# EAGLE design Universal-Sensor_Atmega328 (EAGLE 6.6.0)
Assembly variants: Atmega + TH, P, L, Max (RF), Atmega + TH, P, MAX (RF), Atmega + TH, L, MAX (RF), Atmega + TH, MAX (RF), Atmega + TH, P, L, (Wired)
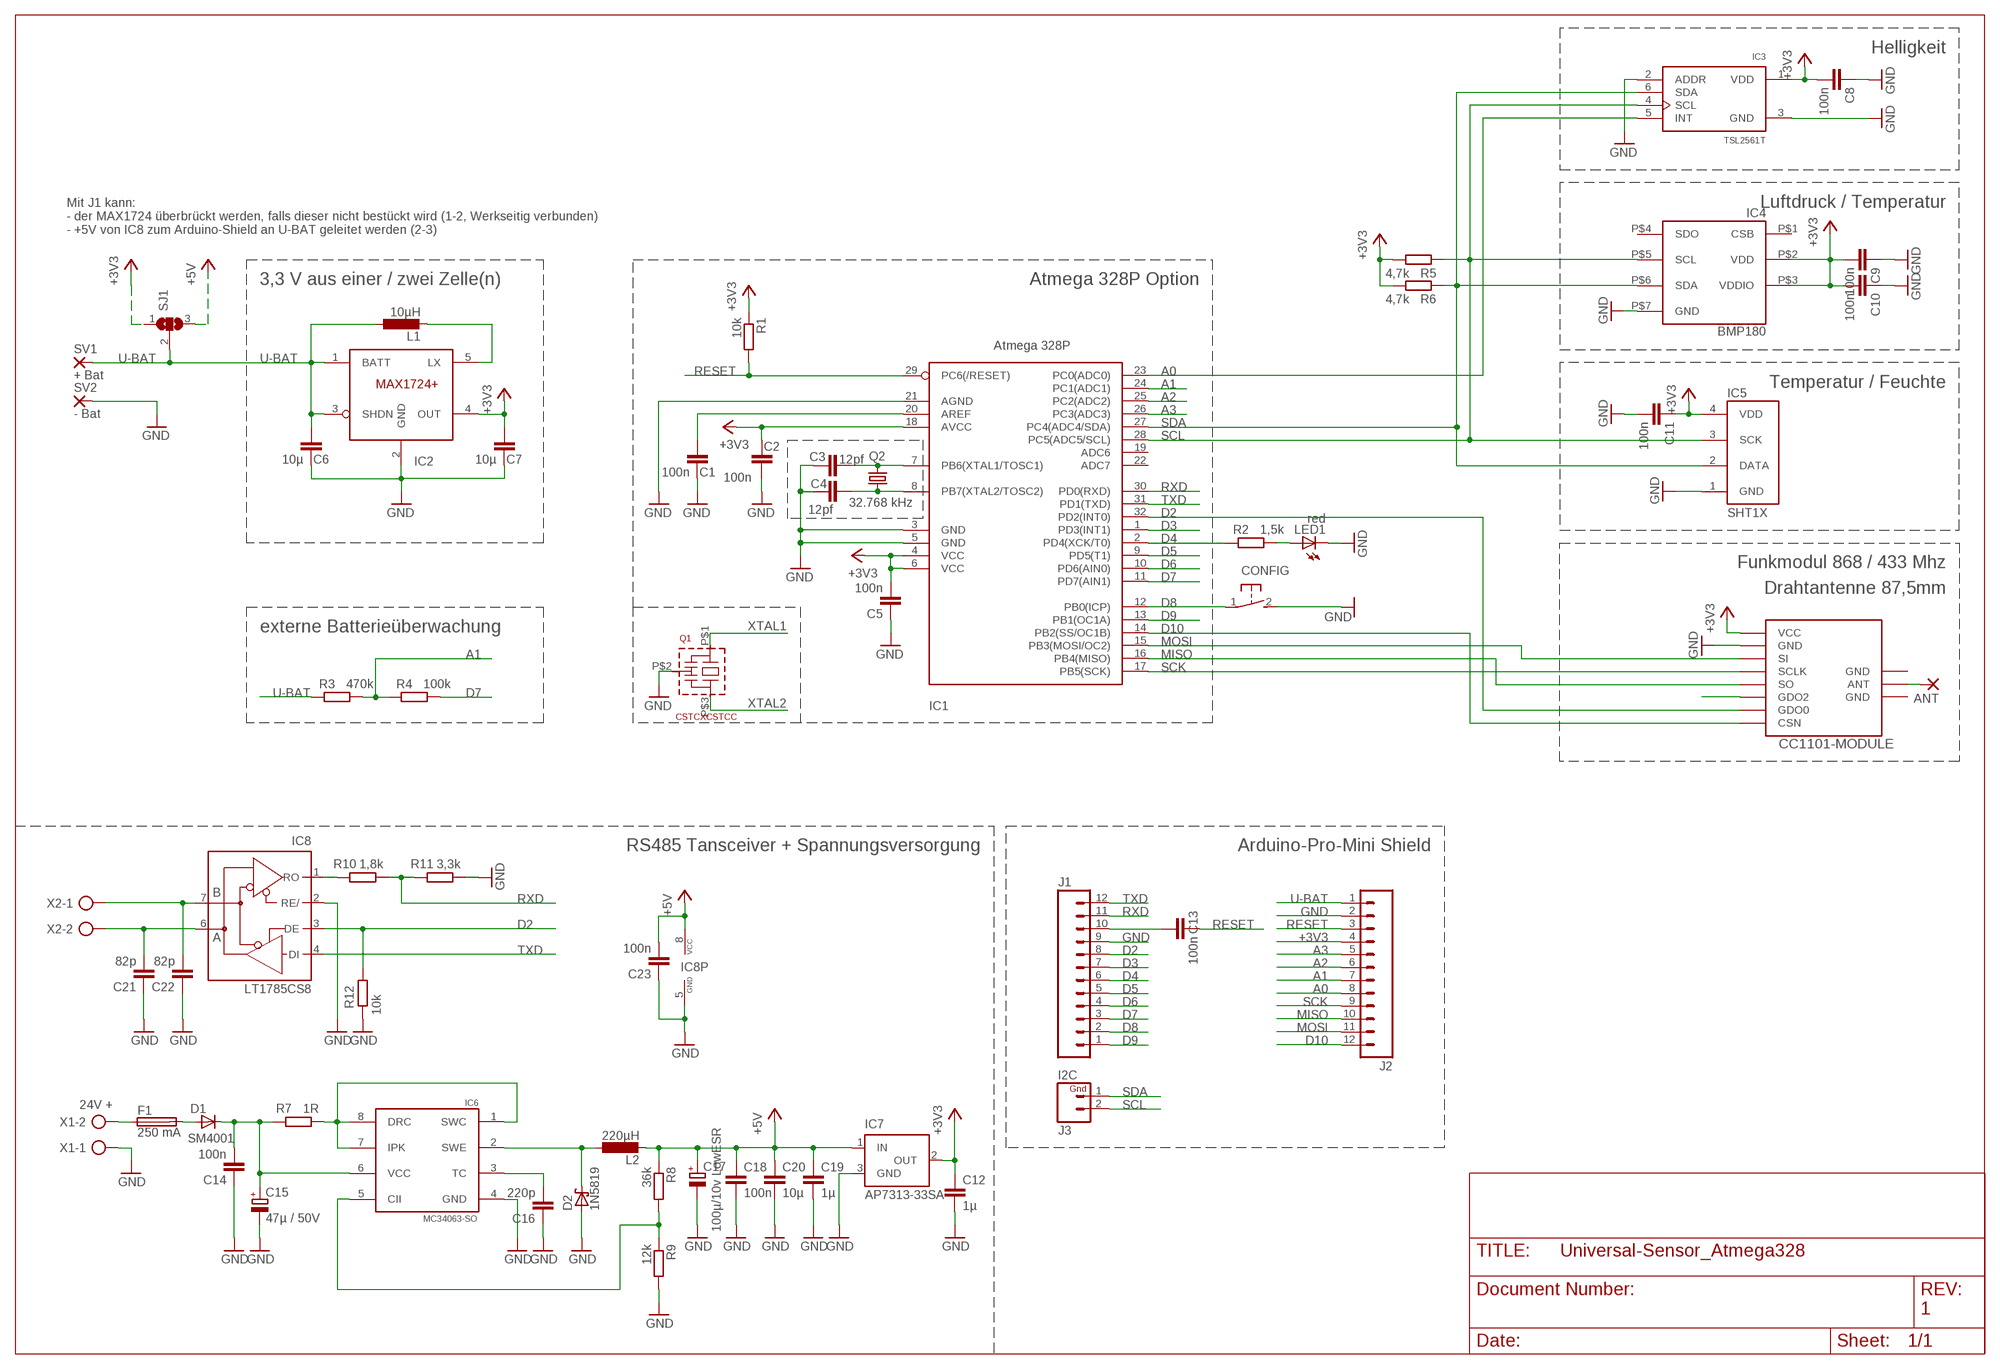
[diagram p0: schematic, sheet 1]

## Parts
ANT  1,6/0,8  [1,6/0,8]  (not fitted in variant Atmega + TH, P, L, (Wired))
C1  100n  C-EUC0805  [C0805]
C2  100n  C-EUC0805  [C0805]
C3  12pf  C-EUC0805  [C0805]  (not fitted in variant Atmega + TH, P, L, Max (RF))  (not fitted in variant Atmega + TH, P, MAX (RF))  (not fitted in variant Atmega + TH, L, MAX (RF))  (not fitted in variant Atmega + TH, MAX (RF))  (not fitted in variant Atmega + TH, P, L, (Wired))
C4  12pf  C-EUC0805  [C0805]  (not fitted in variant Atmega + TH, P, L, Max (RF))  (not fitted in variant Atmega + TH, P, MAX (RF))  (not fitted in variant Atmega + TH, L, MAX (RF))  (not fitted in variant Atmega + TH, MAX (RF))  (not fitted in variant Atmega + TH, P, L, (Wired))
C5  100n  C-EUC0805  [C0805]
C6  10µ  C-EUC1206  [C1206]  (not fitted in variant Atmega + TH, P, L, (Wired))
C7  10µ  C-EUC1206  [C1206]  (not fitted in variant Atmega + TH, P, L, (Wired))
C8  100n  C-EUC0805  [C0805]  (not fitted in variant Atmega + TH, P, MAX (RF))  (not fitted in variant Atmega + TH, MAX (RF))
C9  100n  C-EUC0805  [C0805]  (not fitted in variant Atmega + TH, L, MAX (RF))  (not fitted in variant Atmega + TH, MAX (RF))
C10  100n  C-EUC0805  [C0805]  (not fitted in variant Atmega + TH, L, MAX (RF))  (not fitted in variant Atmega + TH, MAX (RF))
C11  100n  C-EUC0805  [C0805]
C12  1µ  C-EUC0805  [C0805]  (not fitted in variant Atmega + TH, P, L, Max (RF))  (not fitted in variant Atmega + TH, P, MAX (RF))  (not fitted in variant Atmega + TH, L, MAX (RF))  (not fitted in variant Atmega + TH, MAX (RF))
C13  100n  C-EUC0805  [C0805]
C14  100n  C-EUC1206  [C1206]  (not fitted in variant Atmega + TH, P, L, Max (RF))  (not fitted in variant Atmega + TH, P, MAX (RF))  (not fitted in variant Atmega + TH, L, MAX (RF))  (not fitted in variant Atmega + TH, MAX (RF))
C15  47µ / 50V  CPOL-EUE2.5-7  [E2,5-7]  (not fitted in variant Atmega + TH, P, L, Max (RF))  (not fitted in variant Atmega + TH, P, MAX (RF))  (not fitted in variant Atmega + TH, L, MAX (RF))  (not fitted in variant Atmega + TH, MAX (RF))
C16  220p  C-EUC0805  [C0805]  (not fitted in variant Atmega + TH, P, L, Max (RF))  (not fitted in variant Atmega + TH, P, MAX (RF))  (not fitted in variant Atmega + TH, L, MAX (RF))  (not fitted in variant Atmega + TH, MAX (RF))
C17  100µ/10v LowESR  CPOL-EUSMCD  [SMC_D]  (not fitted in variant Atmega + TH, P, L, Max (RF))  (not fitted in variant Atmega + TH, P, MAX (RF))  (not fitted in variant Atmega + TH, L, MAX (RF))  (not fitted in variant Atmega + TH, MAX (RF))
C18  100n  C-EUC0805  [C0805]  (not fitted in variant Atmega + TH, P, L, Max (RF))  (not fitted in variant Atmega + TH, P, MAX (RF))  (not fitted in variant Atmega + TH, L, MAX (RF))  (not fitted in variant Atmega + TH, MAX (RF))
C19  1µ  C-EUC0805  [C0805]  (not fitted in variant Atmega + TH, P, L, Max (RF))  (not fitted in variant Atmega + TH, P, MAX (RF))  (not fitted in variant Atmega + TH, L, MAX (RF))  (not fitted in variant Atmega + TH, MAX (RF))
C20  10µ  C-EUC1206  [C1206]  (not fitted in variant Atmega + TH, P, L, Max (RF))  (not fitted in variant Atmega + TH, P, MAX (RF))  (not fitted in variant Atmega + TH, L, MAX (RF))  (not fitted in variant Atmega + TH, MAX (RF))
C21  82p  C-EUC0805  [C0805]  (not fitted in variant Atmega + TH, P, L, Max (RF))  (not fitted in variant Atmega + TH, P, MAX (RF))  (not fitted in variant Atmega + TH, L, MAX (RF))  (not fitted in variant Atmega + TH, MAX (RF))
C22  82p  C-EUC0805  [C0805]  (not fitted in variant Atmega + TH, P, L, Max (RF))  (not fitted in variant Atmega + TH, P, MAX (RF))  (not fitted in variant Atmega + TH, L, MAX (RF))  (not fitted in variant Atmega + TH, MAX (RF))
C23  100n  C-EUC0805  [C0805]  (not fitted in variant Atmega + TH, P, L, Max (RF))  (not fitted in variant Atmega + TH, P, MAX (RF))  (not fitted in variant Atmega + TH, L, MAX (RF))  (not fitted in variant Atmega + TH, MAX (RF))
CC1101-MODULE  CC1101_WIRELES_MODULE  [CC1101_WIRELES_MODULE]  (not fitted in variant Atmega + TH, P, L, (Wired))
CONFIG  DTSM-3  [DTSM-3]
D1  SM4001  DIODE-MELF-MLL41  [MELF-MLL41]  (not fitted in variant Atmega + TH, P, L, Max (RF))  (not fitted in variant Atmega + TH, P, MAX (RF))  (not fitted in variant Atmega + TH, L, MAX (RF))  (not fitted in variant Atmega + TH, MAX (RF))
D2  1N5819  SCHOTTKY-DIODESMD  [SMB]  (not fitted in variant Atmega + TH, P, L, Max (RF))  (not fitted in variant Atmega + TH, P, MAX (RF))  (not fitted in variant Atmega + TH, L, MAX (RF))  (not fitted in variant Atmega + TH, MAX (RF))
F1  250 mA  SMD-MICRO-FUSE  [SMD-6,1X2,6]  (not fitted in variant Atmega + TH, P, L, Max (RF))  (not fitted in variant Atmega + TH, P, MAX (RF))  (not fitted in variant Atmega + TH, L, MAX (RF))  (not fitted in variant Atmega + TH, MAX (RF))
IC1  Atmega 328P  MEGA8-AI  [TQFP32-08]
IC2  MAX1724  [SOT23-5L]  (not fitted in variant Atmega + TH, P, L, (Wired))
IC3  TSL2561T  TSL2560  [TMB-6]  (not fitted in variant Atmega + TH, MAX (RF))  (not fitted in variant Atmega + TH, P, MAX (RF))
IC4  BMP180  [LGA-7]  (not fitted in variant Atmega + TH, L, MAX (RF))  (not fitted in variant Atmega + TH, MAX (RF))
IC5  SHT1X  [SHT1X]
IC6  MC34063-SO  [SO8]  (not fitted in variant Atmega + TH, P, L, Max (RF))  (not fitted in variant Atmega + TH, P, MAX (RF))  (not fitted in variant Atmega + TH, L, MAX (RF))  (not fitted in variant Atmega + TH, MAX (RF))
IC7  AP7313-33SA  MAX6520  [SOT23]  (not fitted in variant Atmega + TH, P, L, Max (RF))  (not fitted in variant Atmega + TH, P, MAX (RF))  (not fitted in variant Atmega + TH, L, MAX (RF))  (not fitted in variant Atmega + TH, MAX (RF))  (not fitted in variant Atmega + TH, P, L, (Wired))
IC8  LT1785CS8  MAX481CSA  [SO08]  (not fitted in variant Atmega + TH, P, L, Max (RF))  (not fitted in variant Atmega + TH, P, MAX (RF))  (not fitted in variant Atmega + TH, L, MAX (RF))  (not fitted in variant Atmega + TH, MAX (RF))
J1  M12PTH  [1X12]  (not fitted in variant Atmega + TH, P, L, Max (RF))  (not fitted in variant Atmega + TH, P, MAX (RF))  (not fitted in variant Atmega + TH, L, MAX (RF))  (not fitted in variant Atmega + TH, MAX (RF))  (not fitted in variant Atmega + TH, P, L, (Wired))
J2  M12PTH  [1X12]  (not fitted in variant Atmega + TH, P, L, Max (RF))  (not fitted in variant Atmega + TH, P, MAX (RF))  (not fitted in variant Atmega + TH, L, MAX (RF))  (not fitted in variant Atmega + TH, MAX (RF))  (not fitted in variant Atmega + TH, P, L, (Wired))
J3  I2C  M02PTH  [1X02]  (not fitted in variant Atmega + TH, P, L, Max (RF))  (not fitted in variant Atmega + TH, P, MAX (RF))  (not fitted in variant Atmega + TH, L, MAX (RF))  (not fitted in variant Atmega + TH, MAX (RF))  (not fitted in variant Atmega + TH, P, L, (Wired))
L1  10µH  L-EUL4532P  [L4532P]  (not fitted in variant Atmega + TH, P, L, (Wired))
L2  220µH  L-EUL5650M  [L5650M]  (not fitted in variant Atmega + TH, P, L, Max (RF))  (not fitted in variant Atmega + TH, P, MAX (RF))  (not fitted in variant Atmega + TH, L, MAX (RF))  (not fitted in variant Atmega + TH, MAX (RF))
LED1  red  LEDCHIP-LED0805  [CHIP-LED0805]
Q1  CSTCXCSTCC  [CSTCC]  (not fitted in variant Atmega + TH, P, L, Max (RF))  (not fitted in variant Atmega + TH, L, MAX (RF))  (not fitted in variant Atmega + TH, MAX (RF))  (not fitted in variant Atmega + TH, P, MAX (RF))
Q2  32.768 kHz  CRYSTALTC38H  [TC38H]  (not fitted in variant Atmega + TH, P, L, Max (RF))  (not fitted in variant Atmega + TH, P, MAX (RF))  (not fitted in variant Atmega + TH, L, MAX (RF))  (not fitted in variant Atmega + TH, MAX (RF))  (not fitted in variant Atmega + TH, P, L, (Wired))
R1  10k  R-EU_M0805  [M0805]
R2  1,5k  R-EU_M0805  [M0805]
R3  470k  R-EU_M0805  [M0805]  (not fitted in variant Atmega + TH, P, L, (Wired))
R4  100k  R-EU_M0805  [M0805]  (not fitted in variant Atmega + TH, P, L, (Wired))
R5  4,7k  R-EU_M0805  [M0805]
R6  4,7k  R-EU_M0805  [M0805]
R7  1R  R-EU_R0805  [R0805]  (not fitted in variant Atmega + TH, P, L, Max (RF))  (not fitted in variant Atmega + TH, P, MAX (RF))  (not fitted in variant Atmega + TH, L, MAX (RF))  (not fitted in variant Atmega + TH, MAX (RF))
R8  36k  R-EU_R0805  [R0805]  (not fitted in variant Atmega + TH, P, L, Max (RF))  (not fitted in variant Atmega + TH, P, MAX (RF))  (not fitted in variant Atmega + TH, L, MAX (RF))  (not fitted in variant Atmega + TH, MAX (RF))
R9  12k  R-EU_R0805  [R0805]  (not fitted in variant Atmega + TH, P, L, Max (RF))  (not fitted in variant Atmega + TH, P, MAX (RF))  (not fitted in variant Atmega + TH, L, MAX (RF))  (not fitted in variant Atmega + TH, MAX (RF))
R10  1,8k  R-EU_R0805  [R0805]  (not fitted in variant Atmega + TH, P, L, Max (RF))  (not fitted in variant Atmega + TH, P, MAX (RF))  (not fitted in variant Atmega + TH, L, MAX (RF))  (not fitted in variant Atmega + TH, MAX (RF))
R11  3,3k  R-EU_R0805  [R0805]  (not fitted in variant Atmega + TH, P, L, Max (RF))  (not fitted in variant Atmega + TH, P, MAX (RF))  (not fitted in variant Atmega + TH, L, MAX (RF))  (not fitted in variant Atmega + TH, MAX (RF))
R12  10k  R-EU_M0805  [M0805]  (not fitted in variant Atmega + TH, P, L, Max (RF))  (not fitted in variant Atmega + TH, P, MAX (RF))  (not fitted in variant Atmega + TH, L, MAX (RF))  (not fitted in variant Atmega + TH, MAX (RF))
SJ1  SJ2W  [SJ_2]  (not fitted in variant Atmega + TH, P, L, Max (RF))  (not fitted in variant Atmega + TH, L, MAX (RF))  (not fitted in variant Atmega + TH, MAX (RF))  (not fitted in variant Atmega + TH, P, MAX (RF))
SV1  + Bat  1,6/0,9  [1,6/0,9]  (not fitted in variant Atmega + TH, P, L, (Wired))
SV2  - Bat  1,6/0,9  [1,6/0,9]  (not fitted in variant Atmega + TH, P, L, (Wired))
X1  AK550/2  [AK550/2]  (not fitted in variant Atmega + TH, P, L, Max (RF))  (not fitted in variant Atmega + TH, P, MAX (RF))  (not fitted in variant Atmega + TH, L, MAX (RF))  (not fitted in variant Atmega + TH, MAX (RF))
X2  AK550/2  [AK550/2]  (not fitted in variant Atmega + TH, P, L, Max (RF))  (not fitted in variant Atmega + TH, P, MAX (RF))  (not fitted in variant Atmega + TH, L, MAX (RF))  (not fitted in variant Atmega + TH, MAX (RF))

## Nets
+3V3: C2.2 C5.2 C7.2 C8.2 C9.2 C10.2 C11.1 C12.1 CC1101-MODULE.VCC IC1.4(VCC) IC1.6(VCC) IC1.18(AVCC) IC2.4(OUT) IC3.1(VDD) IC4.P$2(VDD) IC4.P$3(VDDIO) IC5.4(VDD) IC7.2(OUT) J2.4 R1.1 R5.2 R6.2 SJ1.1
+5V: C17.+ C18.1 C19.1 C20.1 C23.2 IC7.1(IN) IC8.8(VCC) L2.2 R8.1 SJ1.3
A: C21.2 IC8.6(A) X2.2
A0: IC1.23(PC0(ADC0)) IC3.5(INT) J2.8
A1: IC1.24(PC1(ADC1)) J2.7 R3.2 R4.1
A2: IC1.25(PC2(ADC2)) J2.6
A3: IC1.26(PC3(ADC3)) J2.5
B: C22.2 IC8.7(B) X2.1
D2: CC1101-MODULE.GDO0 IC1.32(PD2(INT0)) IC8.3(DE) J1.8 R12.2
D3: IC1.1(PD3(INT1)) J1.7
D4: IC1.2(PD4(XCK/T0)) J1.6 R2.1
D5: IC1.9(PD5(T1)) J1.5
D6: IC1.10(PD6(AIN0)) J1.4
D7: IC1.11(PD7(AIN1)) J1.3 R4.2
D8: CONFIG.1 IC1.12(PB0(ICP)) J1.2
D9: IC1.13(PB1(OC1A)) J1.1
D10: CC1101-MODULE.CSN IC1.14(PB2(SS/OC1B)) J2.12
GND: C1.1 C2.1 C3.2 C4.2 C5.1 C6.1 C7.1 C8.1 C9.1 C10.1 C11.2 C12.2 C14.1 C15.- C16.1 C17.- C18.2 C19.2 C20.2 C21.1 C22.1 C23.1 CC1101-MODULE.GND@1(GND) CONFIG.2 D2.A IC1.3(GND) IC1.5(GND) IC1.21(AGND) IC2.2(GND) IC3.2(ADDR) IC3.3(GND) IC4.P$7(GND) IC5.1(GND) IC6.4(GND) IC7.3(GND) IC8.2(RE/) IC8.5(GND) J1.9 J2.2 LED1.C Q1.P$2(GND) R9.2 R11.1 R12.1 SV2.1(P) X1.1
MISO: CC1101-MODULE.SO IC1.16(PB4(MISO)) J2.10
MOSI: CC1101-MODULE.SI IC1.15(PB3(MOSI/OC2)) J2.11
N$1: C13.2 J1.10
N$2: IC2.5(LX) L1.2
N$3: CC1101-MODULE.GDO2
N$4: LED1.A R2.2
N$5: ANT.1(P) CC1101-MODULE.ANT
N$9: F1.1 X1.2
N$10: IC8.1(RO) R10.2
N$14: C1.2 IC1.20(AREF)
N$16: D1.A F1.2
N$17: IC6.1(SWC) IC6.7(IPK) IC6.8(DRC) R7.1
N$19: C14.2 C15.+ D1.C IC6.6(VCC) R7.2
N$20: IC6.5(CII) R8.2 R9.1
N$21: C16.2 IC6.3(TC)
N$22: D2.C IC6.2(SWE) L2.1
RESET: C13.1 IC1.29(PC6(/RESET)) J2.3 R1.2
RXD: IC1.30(PD0(RXD)) J1.11 R10.1 R11.2
SCK: CC1101-MODULE.SCLK IC1.17(PB5(SCK)) J2.9
SCL: IC1.28(PC5(ADC5/SCL)) IC3.4(SCL) IC4.P$5(SCL) IC5.3(SCK) J3.2 R5.1
SDA: IC1.27(PC4(ADC4/SDA)) IC3.6(SDA) IC4.P$6(SDA) IC5.2(DATA) J3.1 R6.1
TXD: IC1.31(PD1(TXD)) IC8.4(DI) J1.12
U-BAT: C6.2 IC2.1(BATT) IC2.3(SHDN) J2.1 L1.1 R3.1 SJ1.2 SV1.1(P)
XTAL1: C3.1 IC1.7(PB6(XTAL1/TOSC1)) Q1.P$1 Q2.2
XTAL2: C4.1 IC1.8(PB7(XTAL2/TOSC2)) Q1.P$3 Q2.1
Unconnected: IC1.19(ADC6) IC1.22(ADC7) IC4.P$1(CSB) IC4.P$4(SDO)

## Notes on the sheet
- Helligkeit
- Luftdruck / Temperatur
- Mit J1 kann:
  - der MAX1724 überbrückt werden, falls dieser nicht bestückt wird (1-2, Werkseitig verbunden)
  - +5V von IC8 zum Arduino-Shield an U-BAT geleitet werden (2-3)
- 3,3 V aus einer / zwei Zelle(n) | Atmega 328P Option
- Temperatur / Feuchte
- IC2
- Funkmodul 868 / 433 Mhz
- Drahtantenne 87,5mm
- externe Batterieüberwachung
- RS485 Tansceiver + Spannungsversorgung | Arduino-Pro-Mini Shield
- 24V +
- 1

## Power pins joined to a net without a drawn wire
GND: CC1101-MODULE.GND@2(GND) CC1101-MODULE.GND@3(GND)

## Library data of the parts
ANT = wirepad:1,6/0,8: THROUGH-HOLE PAD
C1-C14 C16 C18-C23 = rcl:C-EU: CAPACITOR, European symbol
C15 C17 = rcl:CPOL-EU: POLARIZED CAPACITOR, European symbol
CC1101-MODULE = untitled:CC1101_WIRELES_MODULE
CONFIG = switch-tact:DTSM-3
D1 = diode:DIODE-: DIODE
D2 = diode:SCHOTTKY-DIODE: Schottky Diode
F1 = f-lf-omniblok-s:SMD-MICRO-FUSE
IC1 = atmel:MEGA8: MICROCONTROLLER 8 Kbytes FLASH 1 kbytes SRAM 512 bytes EEPROM USART 6-channel 10 bit ADC 2-channel 8 bit ADC
IC2 = MAX1724:MAX1724
IC3 = eagle-library-edeca.net-v5:TSL256*: Texas Instruments TSL2560 (SMBus), TSL2561 (I2C) Light-to-digital converter; INTERFACE: SMBus
IC4 = projecttree:BMP180
IC5 = sht10_11_15:SHT1X
IC6 = mc34063:MC34063-SO: DC/DC converter MC34063 in SO08.
IC7 = maxim:MAX6520: 1.2V Voltage Reference 50ppm/°C, SOT23, 3-Terminal Source: Data sheet <http://datasheets.maxim-ic.com/en/ds/MAX6520.pdf>; MF: MAXIM; MPN: MAX6520EUR-T; OC_FARNELL: unknown; OC_NEWARK: 02J4586
IC8 = maxim:MAX481CSA: RS485 TRANSEIVER; MF: MAXIM; MPN: MAX481CSA; OC_FARNELL: unknown; OC_NEWARK: 90C3817
J1 J2 = SparkFun:M12: Header 12 Standard 12-pin 0.1" header. Use with straight break away headers (SKU : PRT-00116), right angle break away headers (PRT-00553), swiss pins (PRT-00743), machine pins (PRT-00117), and female headers (PRT-00115).
J3 = SparkFun:M02: Header 2 Standard 2-pin 0.1" header. Use with straight break away headers (SKU : PRT-00116), right angle break away headers (PRT-00553), swiss pins (PRT-00743), machine pins (PRT-00117), and female headers (PRT-00115). Molex polarized connector foot print use with SKU : PRT-08233 with associated crimp pins and housings.
L1 L2 = rcl:L-EU: INDUCTOR, European symbol
LED1 = led:LED: LED OSRAM: - CHIPLED LG R971, LG N971, LY N971, LG Q971, LY Q971, LO R971, LY R971 LH N974, LH R974 LS Q976, LO Q976, LY Q976 LO Q996 - Hyper CHIPLED LW Q18S LB Q993, LB Q99A, LB R99A - SideLED LS A670, LO A670, LY A670, LG A670, LP A670 LB A673, LV A673, LT A673, LW A673 LH A674 LY A675 LS A676, LA A676, LO A676, LY A676, LW A676 LS A679, LY A679, LG A679 - Hyper Micro SIDELED® LS Y876, LA Y876, LO Y876, LY Y876 LT Y87S - SmartLED LW L88C, LW L88S LB L89C, LB L89S, LG L890 LS L89K, LO L89K, LY L89K LS L896, LA L896, LO L896, LY L896 - TOPLED LS T670, LO T670, LY T670, LG T670, LP T670 LSG T670, LSP T670, LSY T670, LOP T670, LYG T670 LG T671, LOG T671, LSG T671 LB T673, LV T673, LT T673, LW T673 LH T674 LS T676, LA T676, LO T676, LY T676, LB T676, LH T676, LSB T676, LW T676 LB T67C, LV T67C, LT T67C, LS T67K, LO T67K, LY T67K, LW E67C LS E67B, LA E67B, LO E67B, LY E67B, LB E67C, LV E67C, LT E67C LW T67C LS T679, LY T679, LG T679 LS T770, LO T770, LY T770, LG T770, LP T770 LB T773, LV T773, LT T773, LW T773 LH T774 LS E675, LA E675, LY E675, LS T675 LS T776, LA T776, LO T776, LY T776, LB T776 LHGB T686 LT T68C, LB T68C - Hyper Mini TOPLED® LB M676 - Mini TOPLED Santana® LG M470 LS M47K, LO M47K, LY M47K Source: http://www.osram.convergy.de LUXEON: - LUMILED® LXK2-PW12-R00, LXK2-PW12-S00, LXK2-PW14-U00, LXK2-PW14-V00 LXK2-PM12-R00, LXK2-PM12-S00, LXK2-PM14-U00 LXK2-PE12-Q00, LXK2-PE12-R00, LXK2-PE12-S00, LXK2-PE14-T00, LXK2-PE14-U00 LXK2-PB12-K00, LXK2-PB12-L00, LXK2-PB12-M00, LXK2-PB14-N00, LXK2-PB14-P00, LXK2-PB14-Q00 LXK2-PR12-L00, LXK2-PR12-M00, LXK2-PR14-Q00, LXK2-PR14-R00 LXK2-PD12-Q00, LXK2-PD12-R00, LXK2-PD12-S00 LXK2-PH12-R00, LXK2-PH12-S00 LXK2-PL12-P00, LXK2-PL12-Q00, LXK2-PL12-R00 Source: www.luxeon.com KINGBRIGHT: KA-3528ASYC Source: www.kingbright.com
Q1 = murata-cstcc-cstcv-resonators:CSTCX
Q2 = crystal:CRYSTAL: CRYSTAL; OC_FARNELL: unknown; OC_NEWARK: unknown
R1-R12 = rcl:R-EU_: RESISTOR, European symbol
SJ1 = jumper:SJ2W: SMD solder JUMPER
SV1 SV2 = wirepad:1,6/0,9: THROUGH-HOLE PAD
X1 X2 = con-ptr500:AK550/2: CONNECTOR; OC_FARNELL: unknown; OC_NEWARK: unknown

## Net classes
0 default: width 0.203 mm
1 vcc: width 0.254 mm

## Board
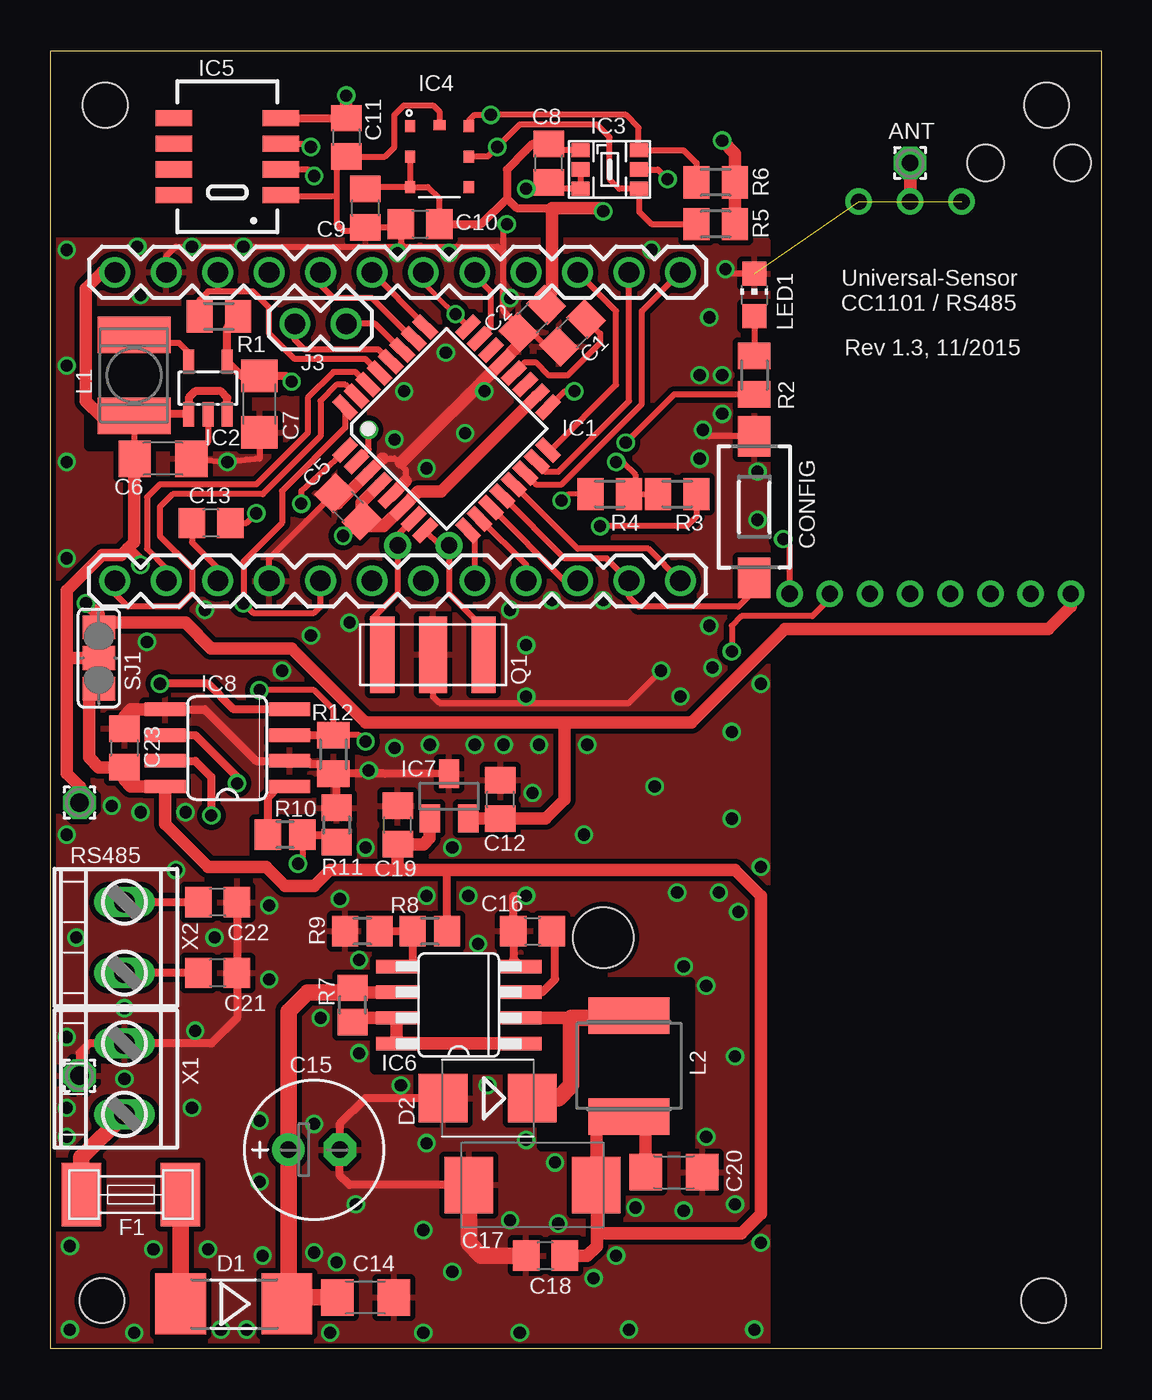
[diagram p1: board, top side]
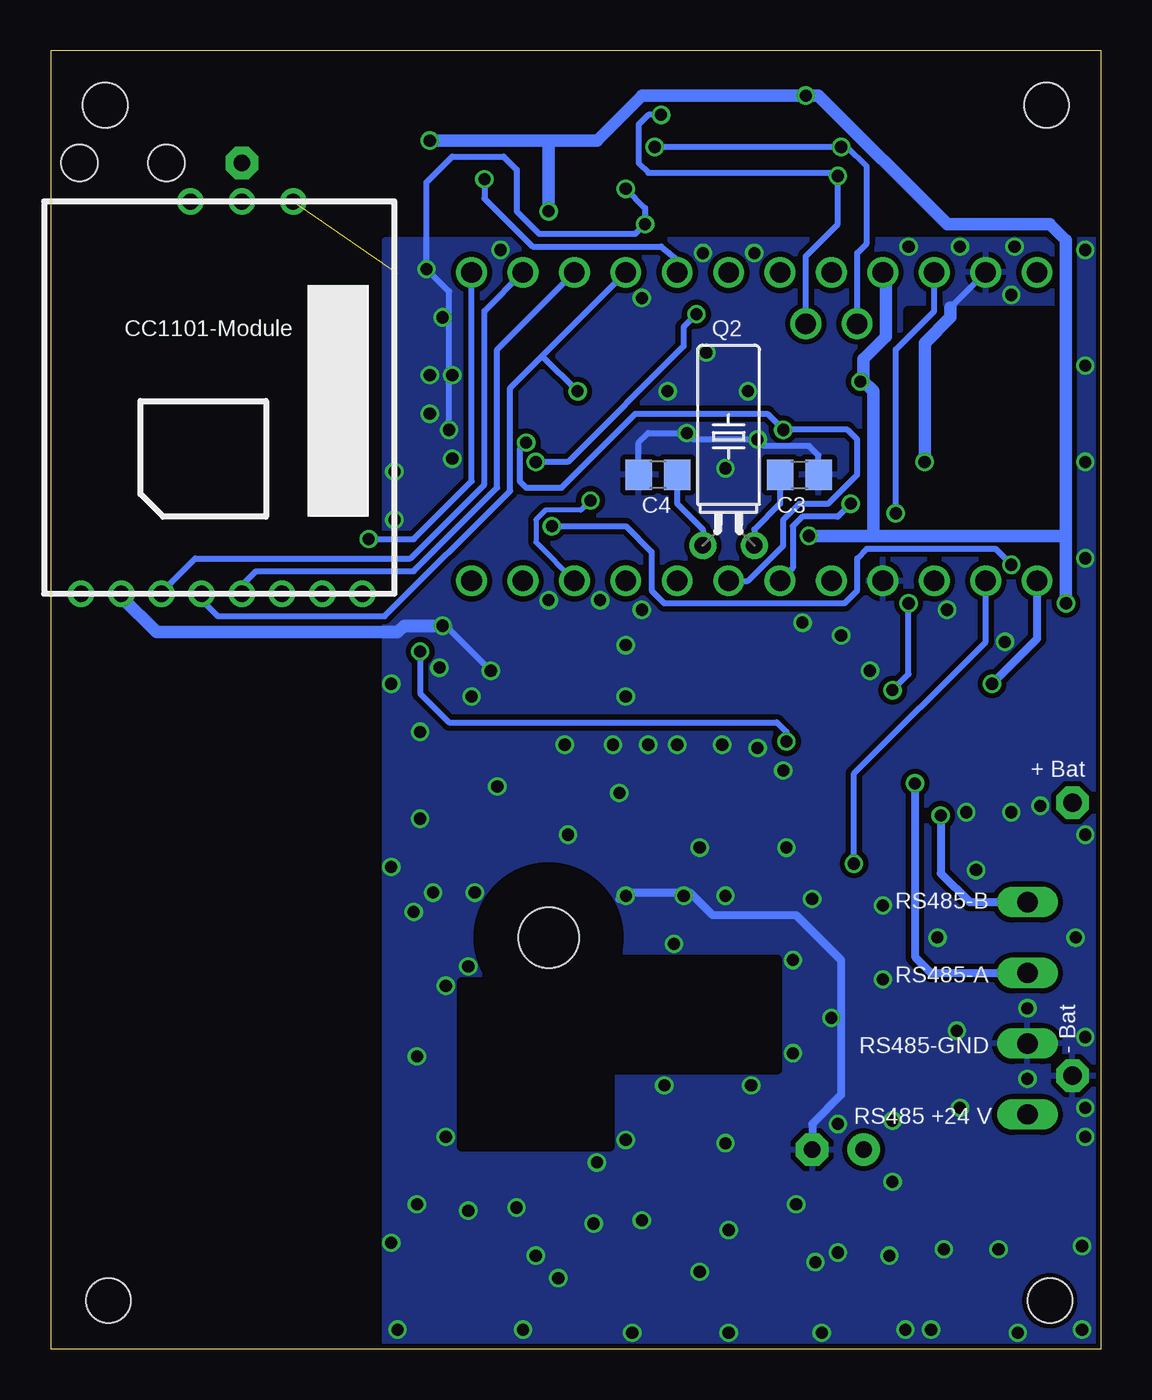
[diagram p2: board, bottom side, seen from below]

Size 51.91 x 64.14 mm. Coordinates in mm from the lower left corner, seen from the top.
Outline: 0,0 0,64.14 51.91,64.14 51.91,0 0,0
Copper layers (1*16): Top 0.035mm / dielectric 1.5mm / Bottom 0.035mm
Design rules "ITEADstudio_DRC": minimum track width 6mil, minimum drill 12mil, track to track 6mil, track to pad 6mil, pad to pad 6mil, via to via 6mil, smd to smd 0mil, copper to edge 10mil, drill to drill 10mil, minimum pad ring 10mil, minimum via ring 6mil, stop-mask expansion 2mil, vias tented up to drill 100mil, thermal gap 10mil
Holes 2.2 mm at 2.54,2.38 49.05,2.38 2.7,61.44 49.21,61.44
Holes 1.8 mm at 46.2,58.58 50.48,58.58
Holes 3 mm at 27.3,20.32
tRestrict: area 1.9,44.6 to 9.7,51.3; area 16,13.8 to 24.1,19.2; area 37,11.1 to 46.7,17.9; area 24.3,10 to 31.6,18.1
bRestrict: area 1.9,43.3 to 9.5,51.3; area 16,13.8 to 24.1,19.2; area 36.8,11.1 to 46.7,17.9; area 24.3,10 to 31.6,18.1; area 24.1,17.1 to 30.6,23.6

### Footprints (pad centres in the part's own frame; a part is rotated, then mirrored left to right if it is on the bottom)
1,6/0,8 = drill 0.813 pad 1.6 octagon: 1 0,0
C0805 = smd 1.3 x 1.5: 1 -0.95,0; 2 0.95,0
C1206 = smd 1.6 x 1.8: 1 -1.4,0; 2 1.4,0
E2,5-7 = drill 0.813 pad 1.6: + -1.27,0 | drill 0.813 pad 1.6 octagon: - 1.27,0
SMC_D = smd 2.4 x 2.8: + -3.15,0; - 3.15,0
CC1101_WIRELES_MODULE = drill 0.8: ANT 19.367,7.541; CSN 0,1.587; GDO0 0,3.572; GDO2 0,5.556; GND@1 0,13.494; GND@2 19.367,10.081; GND@3 19.367,5.001; SCLK 0,9.525; SI 0,11.509; SO 0,7.541; VCC 0,15.478
DTSM-3 = smd 2 x 1.6: 1 -3.494,0; 2 3.494,0
MELF-MLL41 = smd 2.5 x 3: A 2.625,0; C -2.625,0
SMB = smd 2.4 x 2.4: A 2.2,0; C -2.2,0
SMD-6,1X2,6 = smd 1.96 x 3.15: 1 -2.45,0; 2 2.45,0
TQFP32-08 = smd 1.27 x 0.559: 1 -4.293,2.8; 2 -4.293,2; 3 -4.293,1.2; 4 -4.293,0.4; 5 -4.293,-0.4; 6 -4.293,-1.2; 7 -4.293,-2; 8 -4.293,-2.8; 17 4.293,-2.8; 18 4.293,-2; 19 4.293,-1.2; 20 4.293,-0.4; 21 4.293,0.4; 22 4.293,1.2; 23 4.293,2; 24 4.293,2.8 | smd 0.559 x 1.27: 9 -2.8,-4.293; 10 -2,-4.293; 11 -1.2,-4.293; 12 -0.4,-4.293; 13 0.4,-4.293; 14 1.2,-4.293; 15 2,-4.293; 16 2.8,-4.293; 25 2.8,4.293; 26 2,4.293; 27 1.2,4.293; 28 0.4,4.293; 29 -0.4,4.293; 30 -1.2,4.293; 31 -2,4.293; 32 -2.8,4.293
SOT23-5L = smd 0.55 x 1.2: 1 -0.95,-1.3; 2 0,-1.3; 3 0.95,-1.3; 4 0.95,1.3; 5 -0.95,1.3
TMB-6 = smd 0.9 x 0.7: 1 -1.45,0.95; 2 -1.45,0; 3 -1.45,-0.95; 4 1.45,-0.95; 5 1.45,0; 6 1.45,0.95
LGA-7 = smd 0.6 x 0.5: P$1 1.5,1.45; P$2 0,1.45; P$3 -1.5,1.45; P$4 -1.5,-1.45; P$5 0,-1.45; P$6 1.5,-1.45 | smd 0.5 x 0.6: P$7 1.55,0
SHT1X = smd 1.803 x 0.8: 1 -2.642,1.905; 2 -2.642,0.635; 3 -2.642,-0.635; 4 -2.642,-1.905; 5 2.642,-1.905; 6 2.642,-0.635; 7 2.642,0.635; 8 2.642,1.905
SO8 = smd 0.66 x 2.032: 1 -1.905,-3.073; 2 -0.635,-3.073; 3 0.635,-3.073; 4 1.905,-3.073; 5 1.905,3.073; 6 0.635,3.073; 7 -0.635,3.073; 8 -1.905,3.073
SOT23 = smd 1 x 1.4: 1 -0.95,-1.1; 2 0.95,-1.1; 3 0,1.1
SO08 = smd 0.66 x 2.032: 1 -1.905,-3.073; 2 -0.635,-3.073; 3 0.635,-3.073; 4 1.905,-3.073; 5 1.905,3.073; 6 0.635,3.073; 7 -0.635,3.073; 8 -1.905,3.073
1X12 = drill 1.016: 1 0,0; 2 2.54,0; 3 5.08,0; 4 7.62,0; 5 10.16,0; 6 12.7,0; 7 15.24,0; 8 17.78,0; 9 20.32,0; 10 22.86,0; 11 25.4,0; 12 27.94,0
1X02 = drill 1.016: 1 0,0; 2 2.54,0
L4532P = smd 1.8 x 3.6: 1 -2,0; 2 2,0
L5650M = smd 1.8 x 4: 1 -2.5,0; 2 2.5,0
CHIP-LED0805 = smd 1.2 x 1.2: A 0,-1.05; C 0,1.05
CSTCC = smd 1.2 x 3.8: P$1 -2.5,0; P$3 2.5,0 | smd 1.4 x 3.8: P$2 0,0
TC38H = drill 0.813: 1 -1.27,0; 2 1.27,0
M0805 = smd 1.3 x 1.6: 1 -0.95,0; 2 0.95,0
R0805 = smd 1.3 x 1.5: 1 -0.85,0; 2 0.85,0
SJ_2 = smd 1.168 x 1.6: 1 -1.524,0; 2 0,0; 3 1.524,0
1,6/0,9 = drill 0.914 pad 1.6 octagon: 1 0,0
AK550/2 = drill 1 pad 1.5 long: 1 -1.75,0; 2 1.75,0

### Placement (x,y rotation side)
ANT  42.47,58.58 0 top
C1  25.78,50.19 45 top
C2  23.8,50.9 45 top
C3  14.92,43.18 0 bottom
C4  21.91,43.18 180 bottom
C5  14.69,41.6 315 top
C6  5.56,43.97 180 top
C7  10.32,46.67 90 top
C8  24.61,58.58 90 top
C9  15.56,56.36 90 top
C10  18.26,55.56 0 top
C11  14.61,59.85 270 top
C12  22.22,27.15 90 top
C13  7.94,40.8 180 top
C14  15.56,2.54 180 top
C15  13.02,9.84 0 top
C16  23.81,20.64 0 top
C17  23.81,8.1 180 top
C18  24.45,4.6 180 top
C19  17.14,25.88 90 top
C20  30.8,8.73 0 top
C21  8.26,18.57 180 top
C22  8.26,22.07 180 top
C23  3.65,29.69 270 top
CC1101-MODULE  34.93,37.31 90 bottom
CONFIG  34.77,41.59 90 top
D1  9.05,2.22 180 top
D2  21.59,12.38 180 top
F1  3.97,7.62 0 top
IC1  19.56,45.45 45 top
IC2  7.78,47.47 0 top
IC3  27.62,58.26 0 top
IC4  19.21,58.9 90 top
IC5  8.73,58.9 180 top
IC6  20.16,16.99 90 top
IC7  19.68,27.3 0 top
IC8  8.73,29.69 90 top
J1  31.11,37.94 180 top
J2  3.18,53.18 0 top
J3  14.61,50.64 180 top
L1  4.13,48.1 90 top
L2  28.57,13.97 270 top
LED1  34.77,52.07 0 top
Q1  18.89,34.29 0 top
Q2  18.41,39.69 0 bottom
R1  8.31,51 180 top
R2  34.77,48.1 90 top
R3  30.96,42.23 180 top
R4  27.62,42.23 180 top
R5  32.86,55.56 0 top
R6  32.86,57.63 0 top
R7  14.92,16.99 90 top
R8  18.73,20.64 180 top
R9  15.4,20.64 180 top
R10  11.59,25.4 180 top
R11  14.13,25.88 270 top
R12  13.97,29.37 90 top
SJ1  2.38,34.13 270 top
SV1  1.43,26.99 0 top
SV2  1.43,13.49 0 top
X1  3.65,13.34 270 top
X2  3.65,20.32 270 top

### Tracks (layer width: path | path; a pad name or v marks a point on that pad's centre or on a via)
+3V3  (via drill 0.6 pad 0.9)
  Top 0.305: IC4.P$2 IC4.P$3 | C2.2 24.47,51.94 | 15.21,40.92 C5.2 15.65,40.64 | 14.29,60.8 C11.1 | C10.2 19.21,56.84 18.65,57.4 IC4.P$3 | IC4.P$3 15.65,57.4 C9.2 | C7.2 9.42,48.07 | 23.82,59.53 C8.2 24.92,59.21 IC3.1
  Top 0.406: IC5.4 14.29,60.8 | C10.2 21.27,55.56 22.54,56.83 | 22.54,56.83 23.02,56.36 24.77,56.36 | 22.54,56.83 22.54,58.26 23.5,59.21 23.82,59.53 | R1.1 8.73,50.47 IC2.4 9.42,48.07 | C7.2 11.62,48.07 v11.91,47.78
  Top 0.61: CC1101-MODULE.VCC 50.4,36.67 49.29,35.56 36.27,35.56 31.67,30.96 25.4,30.96 | v27.31,56.2 27.15,56.36 24.77,56.36 24.77,52.23 24.47,51.94 | IC1.18 19.28,42.34 18.15,42.34 IC1.6 16.45,40.64 15.65,40.64 | IC1.4 15.36,41.82 C5.2 | R5.2 R6.2 33.81,59.05 v33.18,59.69 | 15.21,40.92 v14.45,40.16 | v14.61,61.91 C11.1 | v1.75,36.83 2.38,36.29 SJ1.1 2.6,35.88 6.67,35.88 7.94,34.61 11.91,34.61 15.56,30.96 25.4,30.96 | 25.4,30.96 25.4,27.15 24.46,26.2 22.23,26.2 C12.1 20.64,26.2 IC7.2
  Bottom 0.305: v11.91,47.78 11.75,48.9
  Bottom 0.61: v1.75,36.83 1.75,40.16 | 1.75,40.16 1.75,54.77 2.54,55.56 7.62,55.56 13.97,61.91 v14.61,61.91 22.7,61.91 24.92,59.69 27.31,59.69 | J2.4 10.64,52.86 10.64,50.01 11.75,48.9 11.75,47.78 11.27,47.31 11.27,40.16 | v33.18,59.69 27.31,59.69 | 27.31,59.69 v27.31,56.2 | v14.45,40.16 11.27,40.16 | 1.75,40.16 11.27,40.16
+5V
  Top 0.406: 3.65,28.1 C23.2 | 18.74,23.65 16.35,23.65 | R8.1 19.58,23.44 19.37,23.65
  Top 0.61: 3.65,28.1 3.97,27.78 IC8.8 5.66,25.93 7.78,23.81 10.64,23.81 11.59,22.86 13.02,22.86 13.81,23.65 16.35,23.65 17.15,23.65 | SJ1.3 2.13,32.61 1.91,32.38 1.91,29.21 2.38,28.73 C23.2 | 17.15,23.65 19.37,23.65 33.81,23.65 35.08,22.38 35.08,6.67 34.13,5.71 26.99,5.71 | 27.35,11.43 27.15,11.43 26.96,11.25 C17.+ 26.99,8.23 26.99,5.71 | 28.26,11.43 28.54,11.43 L2.2 27.35,11.43 | 29.56,11.08 29.22,11.17 | 29.22,11.17 28.26,11.43 | 28.26,11.43 27.35,11.43 | 26.99,5.71 26.99,5.08 26.51,4.6 C18.1 | 17.15,23.65 C19.1 18.42,24.93 18.73,25.24 IC7.1 | C20.1 29.4,10.99 29.22,11.17
A  (via drill 0.6 pad 0.9)
  Top 0.406: C21.2 X2.2 | IC8.6 7.14,30.32 9.21,28.26 v9.21,27.94
  Bottom 0.406: v9.21,27.94 9.21,19.37 8.41,18.57 X2.2
A0  (via drill 0.6 pad 0.9)
  Top 0.305: IC1.23 21.75,50.47 21.75,52.23 20.96,53.02 J2.8 | IC3.5 30,58.26 v30.48,57.78
  Bottom 0.305: v30.48,57.78 30.48,56.83 28.1,54.45 21.75,54.45 20.96,53.82 J2.8
A1  (via drill 0.6 pad 0.9)
  Top 0.254: v20,51.12 19.97,51.12 | 19.97,51.12 19.59,51.5 18.42,52.67 | IC1.24 19.97,51.12
  Top 0.305: 18.42,52.67 J2.7 | R3.2 R4.1 28.89,42.23 28.89,43.18 28.26,43.81 v27.94,43.81 | 20.62,50.5 v20,51.12
  Bottom 0.305: v27.94,43.81 26.35,43.81 20.64,49.53 20.64,50.48 v20,51.12
A2
  Top 0.305: J2.6 18.51,50.55 IC1.25 18.51,50.39
A3
  Top 0.305: IC1.26 17.88,49.9 15.88,51.91 13.97,51.91 13.34,52.55 J2.5
B  (via drill 0.6 pad 0.9)
  Top 0.406: X2.1 C22.2 | IC8.7 7.14,29.05 7.94,28.26 v7.94,26.35
  Bottom 0.406: v7.94,26.35 7.94,23.5 6.51,22.07 X2.1
D2  (via drill 0.6 pad 0.9)
  Top 0.305: IC1.32 14.55,45.51 11.43,42.39 11.43,40.8 9.53,38.89 v9.53,36.83 10,36.35 13.02,36.35 13.34,36.67 J1.8 | v10.32,32.54 13.02,32.54 13.97,31.59 R12.2 14.13,30.32 15.24,30.32 v15.56,30 | CC1101-MODULE.GDO0 38.5,37.07 37.62,36.2 34.13,36.2 33.66,35.72 v33.66,34.45
  Top 0.406: IC8.3 13.81,30.32 R12.2
  Bottom 0.305: v10.32,32.54 9.53,33.34 v9.53,36.83 | v33.66,34.45 33.66,32.38 32.23,30.96 16.03,30.96 15.56,30.48 v15.56,30
D3  (via drill 0.6 pad 0.9)
  Top 0.305: IC1.1 14.08,43.92 12.38,42.39 v12.38,41.75
  Bottom 0.305: v12.38,41.75 13.02,41.12 14.76,41.12 15.24,40.64 15.24,38.58 J1.7
D4  (via drill 0.6 pad 0.9)
  Top 0.305: IC1.2 15.12,43.85 15.72,44.45 v15.72,45.4 | R2.1 30.8,47.15 v28.42,44.77
  Bottom 0.305: J1.6 17.46,37.94 15.72,39.69 15.72,40.96 14.92,41.75 13.49,41.75 12.07,43.18 12.07,44.93 12.54,45.4 v15.72,45.4 16.51,46.2 23.02,46.2 26.67,42.55 28.42,42.55 28.73,42.86 28.73,44.45 v28.42,44.77
D5
  Top 0.305: IC1.9 20.96,40.1 J1.5
D6
  Top 0.305: IC1.10 21.23,41 23.5,38.73 J1.4
D7  (via drill 0.6 pad 0.9)
  Top 0.254: R4.2 25.56,42.23 v25.24,41.91
  Top 0.305: IC1.11 21.77,41.57 25.4,37.94 J1.3
  Bottom 0.254: v25.24,41.91 25.72,41.43 27.46,41.43 27.94,40.96 27.94,39.85 J1.3
D8
  Top 0.305: IC1.12 25.4,39.05 27.46,39.05 J1.2 28.58,37.15 29.05,36.67 33.97,36.67 34.77,37.47 CONFIG.1
D9
  Top 0.305: IC1.13 22.88,42.68 26.04,39.53 29.53,39.53 J1.1
D10  (via drill 0.6 pad 0.9)
  Top 0.305: IC1.14 23.45,43.23 23.97,42.7 25.24,42.7 29.21,46.67 29.21,51.28 J2.12 | CC1101-MODULE.CSN 36.51,39.69 v36.2,40.01
  Bottom 0.305: v36.2,40.01 33.97,40.01 31.12,42.86 J2.12
GND  (via drill 0.6 pad 0.9)  (2 unrouted)
  Top 0.254: 17.32,43.77 17.32,43.66
  Top 0.305: IC3.2 IC3.3 24.92,57.31 C8.1 24.29,57.31 v23.5,57.31 | 16.41,43.99 16.98,43.99 17.32,43.66 17.54,43.43 17.54,42.87 | J1.9 10.8,39.04 C5.1 | 23.13,49.58 C2.1 23.13,50.53 | J2.2 5.72,53.98 6.19,54.45 17.46,54.45 | IC5.1 11.43,56.93 13.87,56.93 14.13,56.99 | 23.13,50.53 22.38,51.28 22.38,54.13 | 23.13,50.53 23.45,50.53 24.45,49.53 25.1,49.53 C1.1 | IC4.P$7 19.21,61.12 18.89,61.44 17.46,61.44 16.99,60.96 16.99,59.37 16.51,58.9 C11.2 14.13,58.26 14.13,56.99 | 17.46,54.45 22.07,54.45 22.38,54.13 | 14.13,56.99 14.13,55.56 14.45,55.24 15.56,55.24 C9.1 17.3,55.41 C10.1 17.31,54.61 17.46,54.45 | 22.38,54.13 22.38,55.4 v22.54,55.56 | IC2.2 7.78,44.8 7.59,44.61 | C6.1 7.61,43.83 7.59,44.61 | C7.1 10.48,44.93 10.32,44.93 10.32,43.97 v8.73,43.81 6.99,43.97 7.59,44.61 | LED1.C 33.56,53.12 v33.34,53.34 | CONFIG.2 32.54,45.09 v32.23,45.4 | Q1.P$2 18.89,32.23 19.21,31.91 28.58,31.91 v30.16,33.5
  Top 0.406: X1.1 7.94,15.08 9.21,16.35 C21.1 C22.1 | X1.1 | 3.65,31.27 C23.1 | 5.72,31.65 IC8.5 7.62,31.59 10.16,29.05 IC8.2 12.7,29.05 12.86,28.89 13.49,28.89 R12.1 | X1.1 1.91,15.08 1.43,14.61 SV2.1 | 14.23,26.83 R11.1 14.13,28.26 R12.1 | IC7.3 16.51,28.42 R12.1 | IC6.4 22.86,19.26 C16.1 22.86,22.38 v23.49,22.38 | D2.A 15.56,12.38 14.29,11.11 C15.- 14.29,8.57 14.76,8.1 C17.-
  Top 0.61: 14.18,41.76 IC1.3 16.41,43.99 | IC1.5 17.54,42.87 | 17.32,43.77 IC1.21 23.13,49.58 | IC8.5 3.97,31.59 3.65,31.27
  Top 0.813: C18.2 21.27,4.6 20.66,5.21 C17.-
  Bottom 0.305: v23.5,57.31 22.54,56.36 v22.54,55.56 23.02,55.09 27.78,55.09 28.89,56.2 28.89,58.26 29.53,58.9 32.07,58.9 33.34,57.63 v33.34,53.34 32.23,52.23 v32.23,45.4 | 7.46,51.44 J2.2 | 20.32,22.54 20.79,22.38 v20.64,22.38 | 32.39,35.72 v30.16,33.5 | C3.2 13.97,44.13 14.45,44.61 16.67,44.61 v16.99,44.93 20.16,44.93 v20.48,45.24 22.38,45.24 22.86,44.77 C4.2
  Bottom 0.406: v23.49,22.38 23.81,22.23 23.5,22.54 20.32,22.54 19.21,21.43 15.08,21.43 12.86,19.21 12.86,12.54 14.29,11.11 C15.-
  Bottom 0.61: v8.73,43.81 8.73,49.69 7.46,50.96 7.46,51.44 | 32.39,35.72 34.45,35.72 34.77,35.4 46.67,35.4 48.42,37.15
  Bottom 0.813: CC1101-MODULE.GND@1 48.42,37.15
  other vias: 19.53,49.21 17.46,47.31 32.54,50.96 33.18,48.1 32.07,43.97 0.79,54.29 0.79,48.58 0.79,43.81 0.79,39.05 34.93,43.34 23.49,10.32 31.11,32.23 32.54,35.72 15.72,28.57 16.99,29.69 15.24,19.21 3.02,26.83 0.79,25.4 1.27,20.32 0.79,15.4 0.79,10.48 0.95,5.08 0.95,0.95 4.13,0.79 5.08,4.92 6.98,11.91 7.14,15.72 7.78,4.92 9.68,0.95 8.41,0.95 10.32,11.27 10.79,18.26 13.34,16.35 15.24,14.61 17.3,13.02 13.02,11.11 10.48,4.6 13.81,0.79 18.41,0.79 18.57,10.16 22.7,6.35 25.08,6.19 32.39,10.48 28.57,0.95 23.18,0.79 26.83,3.49 34.77,0.95 21.11,20 28.89,6.99 19.84,24.77 8.1,20.32 24.13,29.84 33.81,14.45 33.81,7.14 33.97,21.59 24.92,9.21 33.02,22.54 22.38,29.84 23.81,27.46 13.02,4.76 15.08,7.14 18.41,5.87 19.84,3.81 27.94,4.6 14.13,4.29 3.65,16.83 3.65,13.34 35.08,5.24 15.56,24.77 18.73,29.84 20.95,29.84 18.57,22.38 32.39,17.94 21.59,13.02 31.27,6.83 14.29,22.23 10.79,21.91 6.19,23.65 7.62,36.51 11.43,33.5 4.76,34.92 21.43,47.31 18.57,43.5 27.3,36.99 24.76,36.99 12.86,35.24 4.44,26.51 6.67,26.51 10.32,8.26 26.51,29.84 35.08,32.86 35.08,23.81 33.66,30.48 33.66,26.19 26.35,25.4 29.84,27.78 23.49,32.23 23.49,34.77 34.93,40.96 32.7,33.66 29.69,54.29 32.07,48.1 33.18,46.2 4.29,54.45 6.98,54.45 9.53,54.45 4.44,52.07 17.14,54.13 19.68,54.13 22.7,51.91 22.7,36.51 14.76,35.88 0.79,11.91 30.96,22.54 31.27,18.89
  pour Bottom (isolate 0.254): -0.16,0 0,54.77 35.4,54.77 35.4,0
  pour Top (isolate 0.254): -0.16,0 -0.16,54.77 35.4,54.77 35.4,0
MISO
  Top 0.305: J2.10 27.94,51.28 27.94,47.62 24.71,44.4 IC1.16
  Bottom 0.305: J2.10 29.85,49.37 29.85,42.55 33.97,38.42 41.75,38.42 42.47,37.7 CC1101-MODULE.SO
MOSI
  Top 0.305: IC1.15 24.01,43.77 24.45,43.34 25.08,43.34 28.58,46.83 J2.11
  Bottom 0.305: J2.11 30.48,51.28 30.48,42.7 34.13,39.05 44.77,39.05 46.43,37.39 CC1101-MODULE.SI
N$1
  Top 0.305: C13.2 6.99,39.84 8.26,38.58 J1.10
N$2
  Top 0.305: IC2.5 6.83,49.21 6.35,49.69 4.54,49.69 L1.2
N$4
  Top 0.305: LED1.A R2.2
N$5
  Top 0.61: ANT.1 CC1101-MODULE.ANT
N$9
  Top 0.813: F1.1 1.52,9.45 X1.2
N$10
  Top 0.406: R10.2 10.74,27.25 11.27,27.78 IC8.1
N$14
  Top 0.305: C1.2 27.15,50.16 27.15,49.69 25.56,48.1 24.61,48.1 23.97,48.74 23.41,48.74 IC1.20
N$16
  Top 0.813: 6.35,2.94 D1.A F1.2
N$17
  Top 0.406: 15.14,16.35 R7.1
  Top 0.61: 15.14,16.35 IC6.7 IC6.8 IC6.1
N$19
  Top 0.406: 15.14,17.62 R7.2
  Top 0.61: IC6.6 15.14,17.62
  Top 0.813: 15.14,17.62 12.7,17.62 11.75,16.67 C15.+ 11.75,2.3 D1.C | 11.83,2.38 D1.C | C14.2 11.99,2.54 D1.C
N$20
  Top 0.406: R9.1 R8.2 17.88,18.99 17.78,18.89 IC6.5
N$21
  Top 0.406: IC6.3 24.29,17.62 24.92,18.26 24.92,20.48 C16.2
N$22
  Top 0.61: IC6.2 25.72,16.35 | 27.19,16.35 L2.1
  Top 0.813: 27.19,16.35 25.72,16.35 25.72,13.02 25.08,12.38 D2.C
RESET  (via drill 0.6 pad 0.9)
  Top 0.305: IC1.29 15.56,48.9 12.07,48.9 10.8,50.16 10.8,51.44 10,52.23 8.26,52.23 | 8.26,52.23 7.78,52.23 7.36,51.81 R1.2 | C13.1 9.68,40.8 v10.16,41.27 | J2.3 8.26,52.23
  Bottom 0.305: v10.16,41.27 10.16,49.37 8.26,51.28 J2.3
RXD  (via drill 0.6 pad 0.9)
  Top 0.305: IC1.30 15.06,48.26 13.97,48.26 12.7,46.99 12.7,45.24 10.16,42.7 5.4,42.7 4.76,42.07 4.76,39.53 5.72,38.58 J1.11 | R10.1 12.44,24.19 v12.22,23.97
  Top 0.406: R10.1 14.07,25.4 R11.2
  Bottom 0.305: v12.22,23.97 12.22,28.42 5.72,34.92 J1.11
SCK  (via drill 0.6 pad 0.9)
  Top 0.305: IC1.17 24.6,46.51 25.4,47.31 v25.88,47.31
  Bottom 0.305: 27.62,49.05 29.21,47.47 29.21,42.39 35.4,36.2 43.66,36.2 44.45,36.99 CC1101-MODULE.SCLK | 27.62,49.05 J2.9 | v25.88,47.31 27.62,49.05
SCL  (via drill 0.6 pad 0.9)
  Top 0.305: IC5.3 12.7,59.53 v12.86,59.37 | IC4.P$5 21.59,58.9 v22.07,59.37 23.18,60.48 26.99,60.48 27.62,59.85 27.62,57.78 28.1,57.31 IC3.4 29.07,56.18 29.69,55.56 R5.1 | IC1.28 16.79,48.77 16.19,49.37 12.54,49.37 12.07,49.85 J3.2
  Bottom 0.305: v22.07,59.37 v12.86,59.37 12.54,59.37 11.59,58.42 11.59,54.61 12.07,54.13 J3.2
SDA  (via drill 0.6 pad 0.9)
  Top 0.305: v13.02,57.94 12.7,58.26 IC5.2 | IC4.P$6 20.66,60.66 20.96,60.96 v21.75,60.96 28.42,60.96 29.05,60.32 29.05,59.23 IC3.6 31.28,59.21 31.91,58.58 R6.1 | IC1.27 17.34,49.34 16.03,50.64 J3.1
  Bottom 0.305: J3.1 14.61,53.98 13.02,55.56 v13.02,57.94 13.18,58.1 22.38,58.1 22.86,58.58 22.86,60.48 22.38,60.96 v21.75,60.96
TXD  (via drill 0.6 pad 0.9)
  Top 0.305: IC1.31 14.56,47.62 14.13,47.62 13.34,46.83 13.34,45.09 10.48,42.23 6.03,42.23 5.4,41.59 5.4,40.16 6.99,38.58 6.99,37.31 6.35,36.67 3.81,36.67 3.18,37.31 J1.12
  Top 0.406: IC8.4 9.05,31.59 7.78,32.86 v5.4,32.86
  Bottom 0.406: v5.4,32.86 3.18,35.08 J1.12
U-BAT  (via drill 0.6 pad 0.9)
  Top 0.305: L1.1 4.13,44 C6.2 4.13,43.95 | R3.1 31.91,41.11 31.43,40.64 v27.15,40.64
  Top 0.406: L1.1 4.67,46.17 IC2.1 6.83,46.99 7.14,47.31 8.41,47.31 8.73,46.99 IC2.3
  Top 0.61: 3.81,39.53 3.49,39.21 2.54,39.21 0.79,37.47 0.79,34.13 | 3.81,39.53 4.13,39.85 4.13,43.95 | v4.45,38.73 4.45,38.89 3.81,39.53 | SV1.1 1.46,27.02 1.46,27.75 0.79,28.42 0.79,34.13 | J2.1 2.54,53.18 1.75,52.39 1.75,46.83 2.48,46.1 L1.1 | SJ1.2 0.79,34.13
  Bottom 0.305: v27.15,40.64 23.5,40.64 22.23,39.37 22.23,37.47 21.59,36.83 12.7,36.83 12.07,37.47 12.07,39.05 11.59,39.53 5.24,39.53 v4.45,38.73
XTAL1
  Top 0.305: IC1.7 17.15,40.2 Q2.2 17.15,37.31 15.92,36.08 Q1.P$1
  Bottom 0.305: C3.1 15.87,41.75 17.15,40.48 Q2.2
XTAL2
  Top 0.305: IC1.8 19.26,39.69 Q2.1 19.69,37.31 20.92,36.08 Q1.P$3
  Bottom 0.305: C4.1 20.96,41.75 19.69,40.48 Q2.1

### Text on the board
tNames: IC3 | Universal-Sensor / CC1101 / RS485 | Rev 1.3, 11/2015 | RS485
bNames: CC1101-Module | + Bat | RS485-B | RS485-A | - Bat | RS485-GND | RS485 +24 V